# EAGLE schematic BNSK Authoring Light (EAGLE 9.6.2)
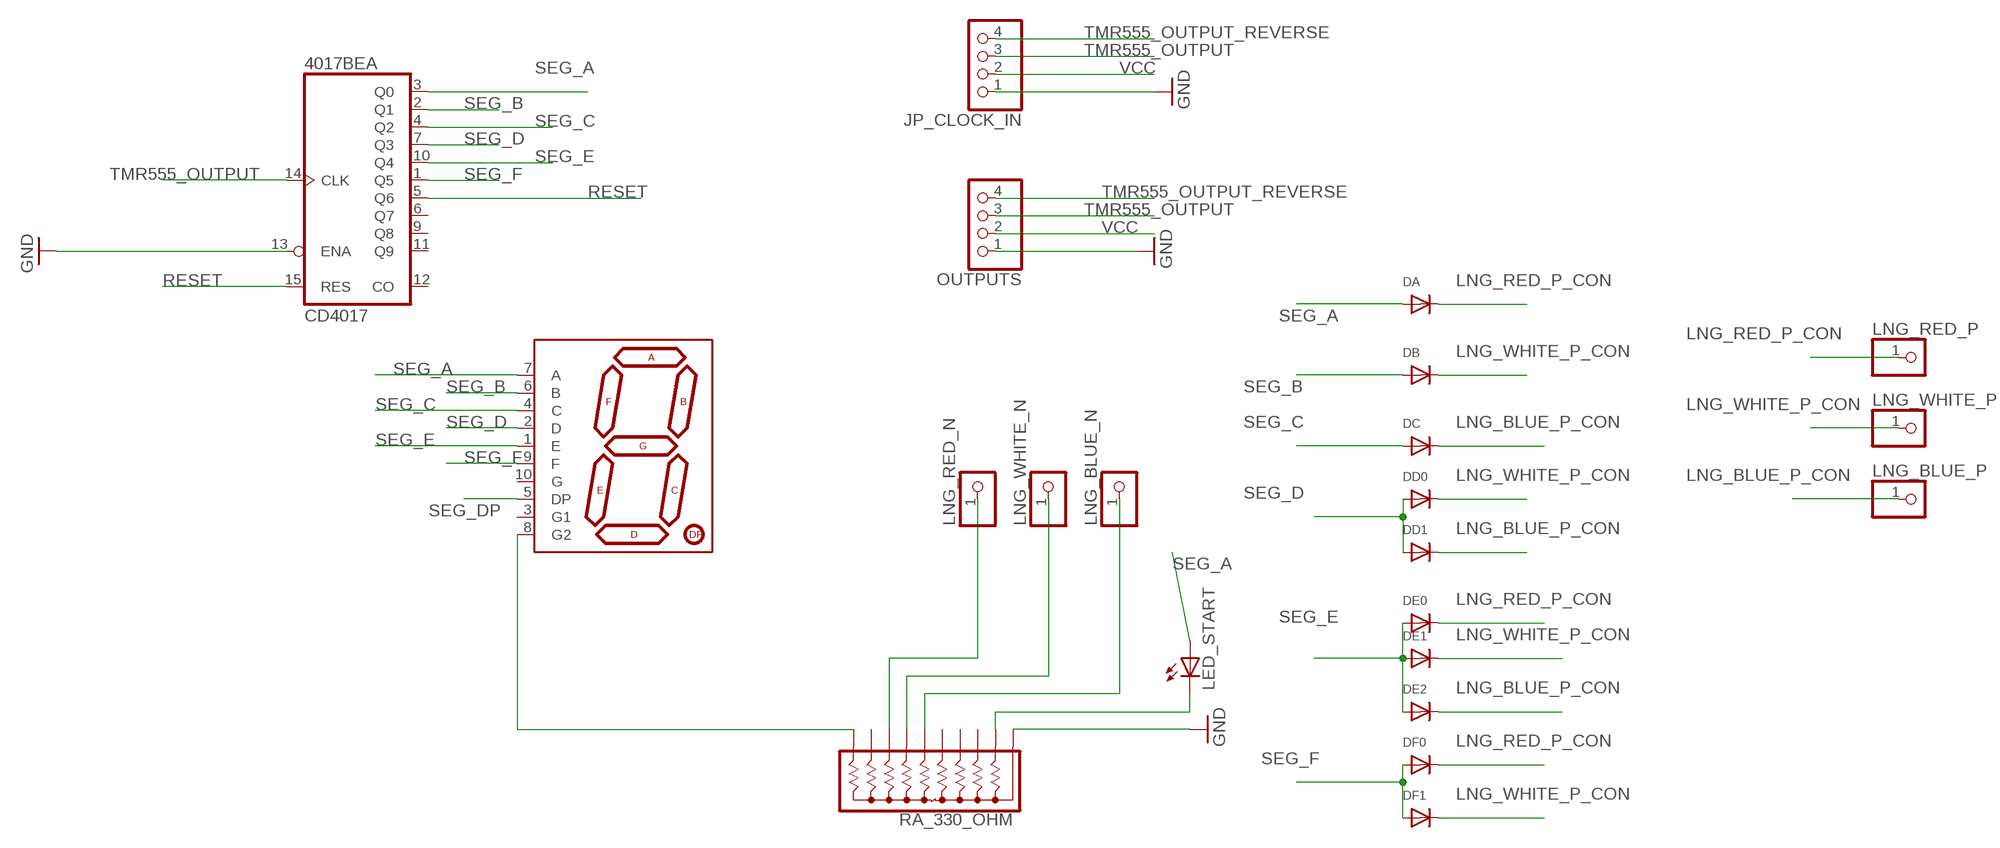
[diagram p0: schematic, sheet 1]

## Parts
4017BE  CD4017  [DIL16]
DA  DIODESMA  [SMADIODE]
DB  DIODESMA  [SMADIODE]
DC  DIODESMA  [SMADIODE]
DD0  DIODESMA  [SMADIODE]
DD1  DIODESMA  [SMADIODE]
DE0  DIODESMA  [SMADIODE]
DE1  DIODESMA  [SMADIODE]
DE2  DIODESMA  [SMADIODE]
DF0  DIODESMA  [SMADIODE]
DF1  DIODESMA  [SMADIODE]
JP_CLOCK_IN  PINHD-1X4  [1X04]
LED_START  LEDSMT1206  [1206]
LNG_BLUE_N  PINHD-1X1  [1X01]
LNG_BLUE_P  PINHD-1X1  [1X01]
LNG_RED_N  PINHD-1X1  [1X01]
LNG_RED_P  PINHD-1X1  [1X01]
LNG_WHITE_N  PINHD-1X1  [1X01]
LNG_WHITE_P  PINHD-1X1  [1X01]
OUTPUTS  PINHD-1X4  [1X04]
RA_330_OHM  4610X  [SIP10]
U$1  7-SEGMENT-DISPLAYPTH  [7-SEGMENT-DISPLAY]

## Nets
GND: 4017BE.13(A:ENA) JP_CLOCK_IN.1 OUTPUTS.1 RA_330_OHM.1
LNG_BLUE_P_CON: DC.C DD1.C DE2.C LNG_BLUE_P.1
LNG_RED_P_CON: DA.C DE0.C DF0.C LNG_RED_P.1
LNG_WHITE_P_CON: DB.C DD0.C DE1.C DF1.C LNG_WHITE_P.1
N$1: LED_START.C RA_330_OHM.2
N$2: RA_330_OHM.10 U$1.8(G2)
N$3: LNG_RED_N.1 RA_330_OHM.8
N$4: LNG_WHITE_N.1 RA_330_OHM.7
N$5: LNG_BLUE_N.1 RA_330_OHM.6
RESET: 4017BE.5(A:Q6) 4017BE.15(A:RES)
SEG_A: 4017BE.3(A:Q0) DA.A LED_START.A U$1.7(A)
SEG_B: 4017BE.2(A:Q1) DB.A U$1.6(B)
SEG_C: 4017BE.4(A:Q2) DC.A U$1.4(C)
SEG_D: 4017BE.7(A:Q3) DD0.A DD1.A U$1.2(D)
SEG_DP: U$1.5(DP)
SEG_E: 4017BE.10(A:Q4) DE0.A DE1.A DE2.A U$1.1(E)
SEG_F: 4017BE.1(A:Q5) DF0.A DF1.A U$1.9(F)
TMR555_OUTPUT: 4017BE.14(A:CLK) JP_CLOCK_IN.3 OUTPUTS.3
TMR555_OUTPUT_REVERSE: JP_CLOCK_IN.4 OUTPUTS.4
VCC: JP_CLOCK_IN.2 OUTPUTS.2
Unconnected: 4017BE.6(A:Q7) 4017BE.9(A:Q8) 4017BE.11(A:Q9) 4017BE.12(A:CO) RA_330_OHM.3 RA_330_OHM.4 RA_330_OHM.5 RA_330_OHM.9 U$1.3(G1) U$1.10(G)

## Power pins joined to a net without a drawn wire
GND: 4017BE.8(P:GND)
VCC: 4017BE.16(P:VCC)

## Library data of the parts
4017BE = SparkFun-DigitalIC:CD4017; PROD_ID: IC-11929
DA DB DC DD0 DD1 DE0 DE1 DE2 DF0 DF1 = adafruit:DIODE: Diode SMADIODE - SMA Surface Mount Package 20V 1A Schottky Diode Digikey: 641-1014-6-ND DO-1N4148 - Through Hole Small Current Diode SOD-123 20V 1 A (.5mV Vf) Schottky Diode - Digikey: MBRX120TPMSCT-ND SOD-323 10V 570mA (.38mV Vf, 3ns) Schottky Diode - Digikey: ZLLS410CT-ND SOD-523 30V 30mA Schottky Diode (RB751S-40TE61) - Digikey: RB751S-40TE61CT-ND SOT23-R/W - SOT23 Package (R = Solder Paste/Reflow Ovens, W = Hand-Soldering) BAT54Film 40V 300mA - Digikey: 497-7162-1-ND
JP_CLOCK_IN OUTPUTS = pinhead:PINHD-1X4: PIN HEADER
LED_START = adafruit:LED: LED OSRAM: - CHIPLED LG R971, LG N971, LY N971, LG Q971, LY Q971, LO R971, LY R971 LH N974, LH R974 LS Q976, LO Q976, LY Q976 LO Q996 - Hyper CHIPLED LW Q18S LB Q993, LB Q99A, LB R99A - SideLED LS A670, LO A670, LY A670, LG A670, LP A670 LB A673, LV A673, LT A673, LW A673 LH A674 LY A675 LS A676, LA A676, LO A676, LY A676, LW A676 LS A679, LY A679, LG A679 - Hyper Micro SIDELED® LS Y876, LA Y876, LO Y876, LY Y876 LT Y87S - SmartLED LW L88C, LW L88S LB L89C, LB L89S, LG L890 LS L89K, LO L89K, LY L89K LS L896, LA L896, LO L896, LY L896 - TOPLED LS T670, LO T670, LY T670, LG T670, LP T670 LSG T670, LSP T670, LSY T670, LOP T670, LYG T670 LG T671, LOG T671, LSG T671 LB T673, LV T673, LT T673, LW T673 LH T674 LS T676, LA T676, LO T676, LY T676, LB T676, LH T676, LSB T676, LW T676 LB T67C, LV T67C, LT T67C, LS T67K, LO T67K, LY T67K, LW E67C LS E67B, LA E67B, LO E67B, LY E67B, LB E67C, LV E67C, LT E67C LW T67C LS T679, LY T679, LG T679 LS T770, LO T770, LY T770, LG T770, LP T770 LB T773, LV T773, LT T773, LW T773 LH T774 LS E675, LA E675, LY E675, LS T675 LS T776, LA T776, LO T776, LY T776, LB T776 LHGB T686 LT T68C, LB T68C - Hyper Mini TOPLED® LB M676 - Mini TOPLED Santana® LG M470 LS M47K, LO M47K, LY M47K Source: http://www.osram.convergy.de/
LNG_BLUE_N LNG_BLUE_P LNG_RED_N LNG_RED_P LNG_WHITE_N LNG_WHITE_P = pinhead:PINHD-1X1: PIN HEADER
RA_330_OHM = resistor-sip:4610X: Bourns 4600X Series - Thick Film Conformal SIPs 4610X-101 Resistor Network Configuration: 101 (Bussed Resistors) Resistance range: 10 ohms to 10 Megaohms Maximum Operating Voltage: 100V Source: http://www.bourns.com/ProductLine.aspx?name=standard_thick_film_networks PDF: http://www.bourns.com/data/global/pdfs/4600X.pdf
U$1 = SparkFun-Displays:7-SEGMENT-DISPLAY